# Altium schematic sheet emitters1.SchDoc
size A4
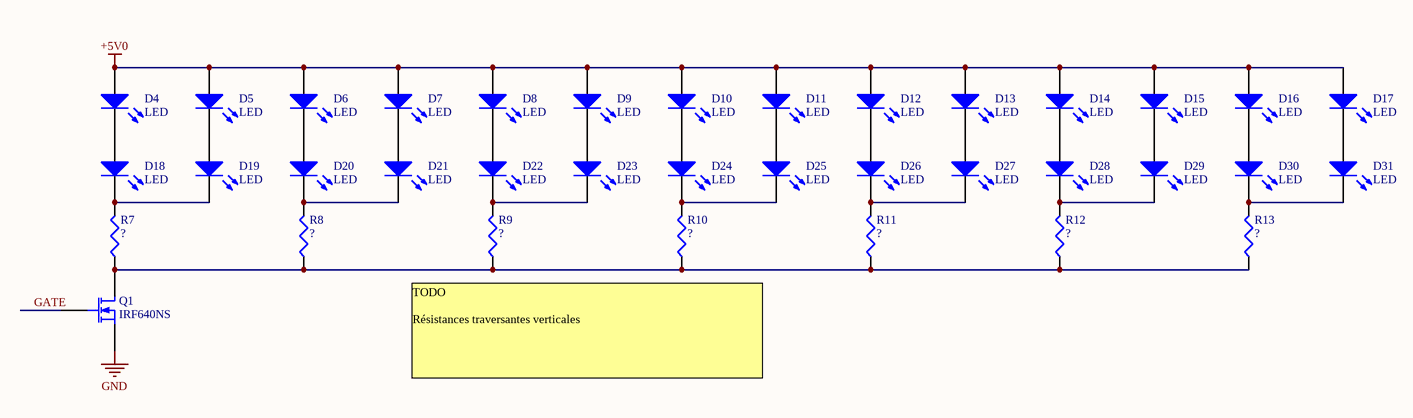
[diagram p0: emitters1.SchDoc]

## Parts
D4  LED  [LED 5MM Horiz]
D5  LED  [LED 5MM Horiz]
D6  LED  [LED 5MM Horiz]
D7  LED  [LED 5MM Horiz]
D8  LED  [LED 5MM Horiz]
D9  LED  [LED 5MM Horiz]
D10  LED  [LED 5MM Horiz]
D11  LED  [LED 5MM Horiz]
D12  LED  [LED 5MM Horiz]
D13  LED  [LED 5MM Horiz]
D14  LED  [LED 5MM Horiz]
D15  LED  [LED 5MM Horiz]
D16  LED  [LED 5MM Horiz]
D17  LED  [LED 5MM Horiz]
D18  LED  [LED 5MM Horiz]
D19  LED  [LED 5MM Horiz]
D20  LED  [LED 5MM Horiz]
D21  LED  [LED 5MM Horiz]
D22  LED  [LED 5MM Horiz]
D23  LED  [LED 5MM Horiz]
D24  LED  [LED 5MM Horiz]
D25  LED  [LED 5MM Horiz]
D26  LED  [LED 5MM Horiz]
D27  LED  [LED 5MM Horiz]
D28  LED  [LED 5MM Horiz]
D29  LED  [LED 5MM Horiz]
D30  LED  [LED 5MM Horiz]
D31  LED  [LED 5MM Horiz]
Q1  IRF640NS  [D2PAK]
R7  RES  [C0805R]  (value not drawn)
R8  RES  [C0805R]  (value not drawn)
R9  RES  [C0805R]  (value not drawn)
R10  RES  [C0805R]  (value not drawn)
R11  RES  [C0805R]  (value not drawn)
R12  RES  [C0805R]  (value not drawn)
R13  RES  [C0805R]  (value not drawn)

## Nets
+5V0: D4.1(A) D5.1(A) D6.1(A) D7.1(A) D8.1(A) D9.1(A) D10.1(A) D11.1(A) D12.1(A) D13.1(A) D14.1(A) D15.1(A) D16.1(A) D17.1(A)
GND: Q1.3(S)
GATE: Q1.1(G)
NetD4_2: D4.2(K) D18.1(A)
NetD5_2: D5.2(K) D19.1(A)
NetD6_2: D6.2(K) D20.1(A)
NetD7_2: D7.2(K) D21.1(A)
NetD8_2: D8.2(K) D22.1(A)
NetD9_2: D9.2(K) D23.1(A)
NetD10_2: D10.2(K) D24.1(A)
NetD11_2: D11.2(K) D25.1(A)
NetD12_2: D12.2(K) D26.1(A)
NetD13_2: D13.2(K) D27.1(A)
NetD14_2: D14.2(K) D28.1(A)
NetD15_2: D15.2(K) D29.1(A)
NetD16_2: D16.2(K) D30.1(A)
NetD17_2: D17.2(K) D31.1(A)
NetD18_2: D18.2(K) D19.2(K) R7.2
NetD20_2: D20.2(K) D21.2(K) R8.2
NetD22_2: D22.2(K) D23.2(K) R9.2
NetD24_2: D24.2(K) D25.2(K) R10.2
NetD26_2: D26.2(K) D27.2(K) R11.2
NetD28_2: D28.2(K) D29.2(K) R12.2
NetD30_2: D30.2(K) D31.2(K) R13.2
NetQ1_2: Q1.2(D) R7.1 R8.1 R9.1 R10.1 R11.1 R12.1 R13.1

## Notes on the sheet
- TODO
  Résistances traversantes verticales

## Library data of the parts
D4-D31 = LED: Typical RED, GREEN, YELLOW, AMBER GaAs LED; Published: 8-Jun-2000; LatestRevisionDate: 17-Jul-2002; LatestRevisionNote: Re-released for DXP Platform.; PackageVersion: Feb-2002; PackageReference: 3.2X1.6X1.1; Publisher: Altium Limited; PackageDescription: SM LED; 2 Flat Leads
Q1 = IRF640: N-Channel MOSFET, D2PAK (T0-263), InternationalRectifier; Published: 8-Jun-2000; LatestRevisionDate: 17-Jul-2002; LatestRevisionNote: Re-released for DXP Platform.; PackageVersion: 1995/1996; PackageReference: E3; Publisher: Altium Limited; PackageDescription: TO, Flat Index; 3 In-Line, Axial Leads; Body Dia. 4.6mm; Lead Dia. 0.5 mm (max)
R7-R13 = RES: Resistor; Published: 8-Jun-2000; LatestRevisionDate: 29-May-2009; LatestRevisionNote: IPC-7351 Footprint Added.; PackageReference: J1-0603; Publisher: Altium Limited; PackageDescription: Chip Resistor; Value: ?